# Altium project SUBBOARD-aux_supply.PrjPcb
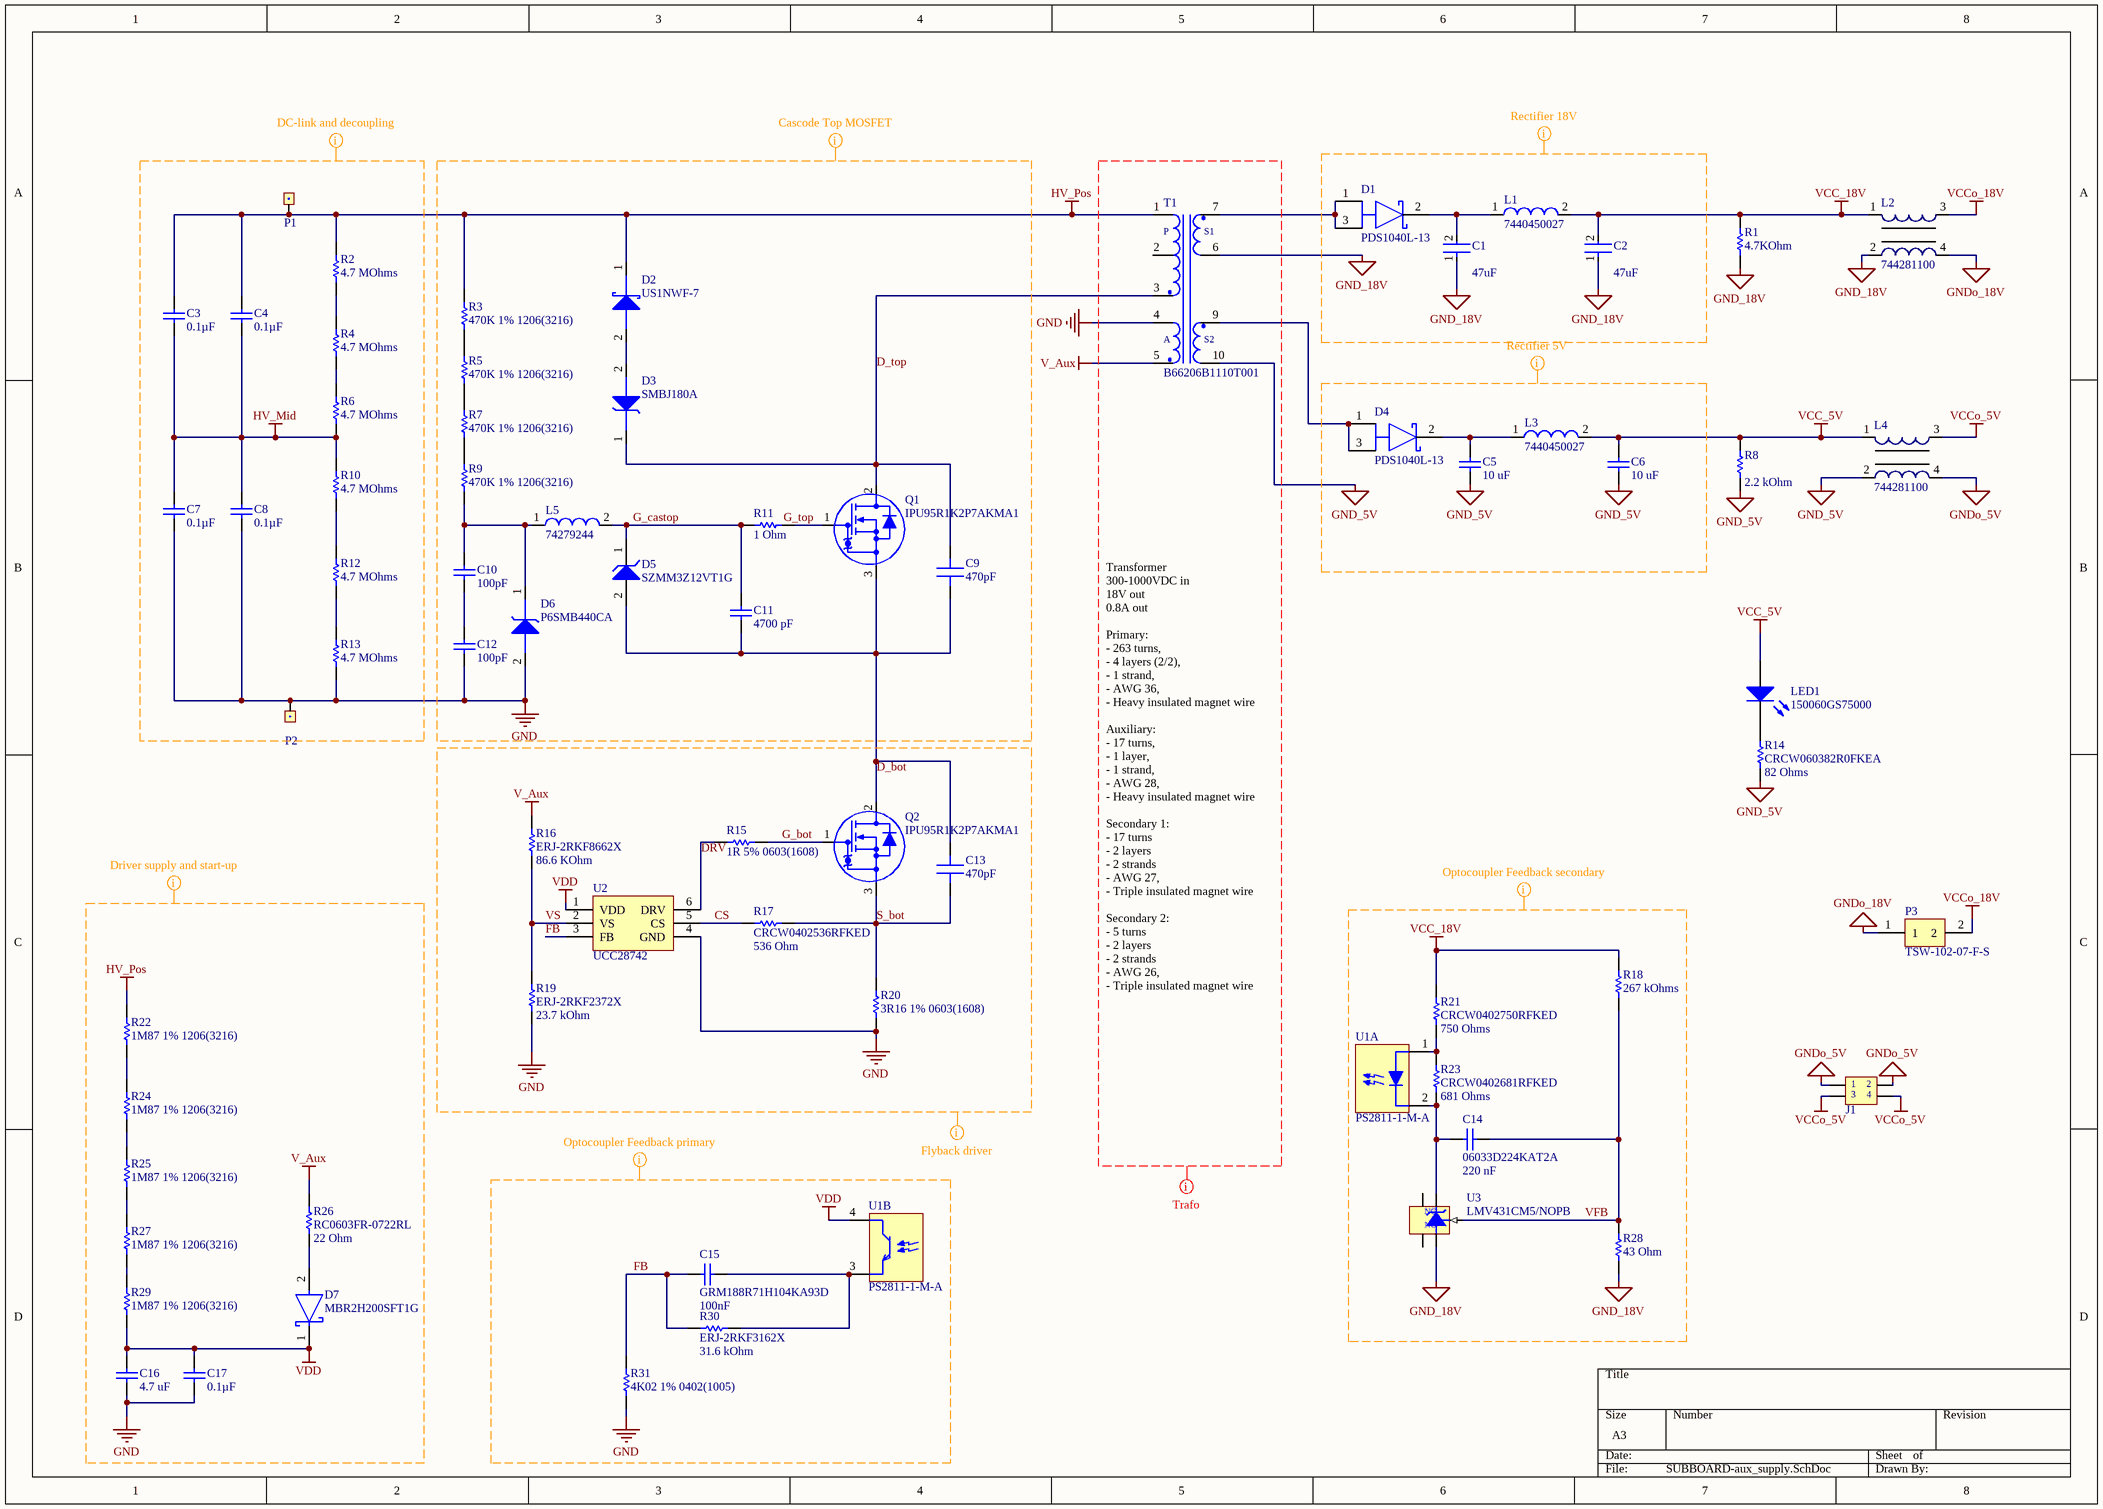
[diagram p0: SUBBOARD-aux_supply.SchDoc]
1 sheet, 71 parts. Net scope: global (net labels, ports and power ports of the same name join across sheets).
Board file: SUBBOARD-aux_supply.PcbDoc

## Sheet SUBBOARD-aux_supply.SchDoc
size A3

### Parts
C1  value 47uF  [FP-C3216-160-MFG]  (hidden comment: C3216X5R1E476M160AC)
C2  value 47uF  [FP-C3216-160-MFG]  (hidden comment: C3216X5R1E476M160AC)
C3  Capacitance: 0.1µF  [VISH-VJ1812-2_L]  (hidden comment: VJ1812Y104KXEAT5Z)
C4  Capacitance: 0.1µF  [VISH-VJ1812-2_L]  (hidden comment: VJ1812Y104KXEAT5Z)
C5  value 10 uF  [CAPC2013X140X45NL15T25]  (hidden comment: GRM21BR71A106KE51L)
C6  value 10 uF  [CAPC2013X140X45NL15T25]  (hidden comment: GRM21BR71A106KE51L)
C7  Capacitance: 0.1µF  [VISH-VJ1812-2_L]  (hidden comment: VJ1812Y104KXEAT5Z)
C8  Capacitance: 0.1µF  [VISH-VJ1812-2_L]  (hidden comment: VJ1812Y104KXEAT5Z)
C9  Capacitance: 470pF  [CAPC1808(4520)215_L]  (hidden comment: C4520X7R3A471K130KA)
C10  value 100pF  [CAPC1206(3216)170_L]  (hidden comment: CAP 100pF 500V 1206(3216))
C11  Capacitance: 4700 pF  [CAPC2013X110X50LL20T25]  (hidden comment: C0805C472J5RACTU)
C12  value 100pF  [CAPC1206(3216)170_L]  (hidden comment: CAP 100pF 500V 1206(3216))
C13  Capacitance: 470pF  [CAPC1808(4520)215_L]  (hidden comment: C4520X7R3A471K130KA)
C14  06033D224KAT2A  Capacitance: 220 nF  [CAPC1608X90X35NL15T15]
C15  GRM188R71H104KA93D  Capacitance: 100nF  [CAPC1608X90X35LL10T15]
C16  Capacitance: 4.7 uF  [CAPC2013X95X45NL15T25]  (hidden comment: GRM219R6YA475MA73D)
C17  Capacitance: 0.1µF  [SAMS-C0603-2_L]  (hidden comment: CL10B104KB8NNNC)
D1  PDS1040L-13  [FP-PowerDI5-MFG]
D2  US1NWF-7  [SOD123F]
D3  SMBJ180A  [DO-214AA SMB]
D4  PDS1040L-13  [FP-PowerDI5-MFG]
D5  SZMM3Z12VT1G  [ONSC-SOD-323-2-477-02_V]
D6  P6SMB440CA  [DO-214AA SMB]
D7  MBR2H200SFT1G  [FP-498-MFG]
J1  SQT-102-01-F-D  [SQT-102-01-F-D]  (value not drawn)
L1  7440450027  [WE-LQ-L]
L2  744281100  [WE-SCC 7345]
L3  7440450027  [WE-LQ-L]
L4  744281100  [WE-SCC 7345]
L5  74279244  [SMD-1806]
LED1  150060GS75000  [0603_A]
P1  TSW-101-07-F-S  [TSW-101-07-F-S]  (value not drawn)
P2  TSW-101-07-F-S  [TSW-101-07-F-S]  (value not drawn)
P3  TSW-102-07-F-S  [TSW-102-07-F-S]
Q1  IPU95R1K2P7AKMA1  [IPAK]
Q2  IPU95R1K2P7AKMA1  [IPAK]
R1  Resistance: 4.7KOhm  [RESC3216X60X45LL15T20]  (hidden comment: CRCW12064K70FKEA)
R2  value 4.7 MOhms  [RESC3216X60X45LL10T20]  (hidden comment: CRCW12064M70FKEA)
R3  470K 1% 1206(3216)  [RESC1206(3216)_L]
R4  value 4.7 MOhms  [RESC3216X60X45LL10T20]  (hidden comment: CRCW12064M70FKEA)
R5  470K 1% 1206(3216)  [RESC1206(3216)_L]
R6  value 4.7 MOhms  [RESC3216X60X45LL10T20]  (hidden comment: CRCW12064M70FKEA)
R7  470K 1% 1206(3216)  [RESC1206(3216)_L]
R8  value 2.2 kOhm  [RESC3216X60X45LL10T20]  (hidden comment: CRCW12062K20FKEA)
R9  470K 1% 1206(3216)  [RESC1206(3216)_L]
R10  value 4.7 MOhms  [RESC3216X60X45LL10T20]  (hidden comment: CRCW12064M70FKEA)
R11  value 1 Ohm  [RESC0603(1608)_L]  (hidden comment: 1R 5% 0603(1608))
R12  value 4.7 MOhms  [RESC3216X60X45LL10T20]  (hidden comment: CRCW12064M70FKEA)
R13  value 4.7 MOhms  [RESC3216X60X45LL10T20]  (hidden comment: CRCW12064M70FKEA)
R14  CRCW060382R0FKEA  value 82 Ohms  [RESC1609X50X30LL10T20]
R15  1R 5% 0603(1608)  [RESC0603(1608)_L]
R16  ERJ-2RKF8662X  Resistance: 86.6 KOhm  [RESC1005X40X25ML05T05]
R17  CRCW0402536RFKED  Resistance: 536 Ohm  [RESC1005X40X25ML05T05]
R18  Resistance: 267 kOhms  [RESC1005X40X25NL05T05]  (hidden comment: CRCW0402267KFKED)
R19  ERJ-2RKF2372X  Resistance: 23.7 kOhm  [RESC1005X40X25NL05T05]
R20  3R16 1% 0603(1608)  [RESC0603(1608)_L]
R21  CRCW0402750RFKED  Resistance: 750 Ohms  [RESC1005X40X25NL05T05]
R22  1M87 1% 1206(3216)  [RESC1206(3216)_L]
R23  CRCW0402681RFKED  Resistance: 681 Ohms  [RESC1005X40X25LL05T05]
R24  1M87 1% 1206(3216)  [RESC1206(3216)_L]
R25  1M87 1% 1206(3216)  [RESC1206(3216)_L]
R26  RC0603FR-0722RL  Resistance: 22 Ohm  [RESC1608X55X25NL10T15]
R27  1M87 1% 1206(3216)  [RESC1206(3216)_L]
R28  Resistance: 43 Ohm  [RESC1005X40X25ML05T05]  (hidden comment: ERJ-2GEJ430X)
R29  1M87 1% 1206(3216)  [RESC1206(3216)_L]
R30  ERJ-2RKF3162X  Resistance: 31.6 kOhm  [RESC1005X40X25NL05T05]
R31  4K02 1% 0402(1005)  [RESC0402(1005)_N]
T1  B66206B1110T001  [B66206B1110T001]
U1  PS2811-1-M-A  [SOP127P700X210-4L]  (parts A,B of 2)
U2  UCC28742  [SOT95P280X145-6L]
U3  LMV431CM5/NOPB  [DBV0005A_L]

### Nets
GND: C7.2 C8.2 C12.1 C16.1 C17.2 D6.2(Anode) P2.1 R13.1 R19.2 R20.1 R31.1 T1.4 U2.4(GND)
GND_5V: C5.1 C6.1 L4.2 R8.2 R14.2 T1.10
GND_18V: C1.1 C2.1 L2.2 R1.2 R28.2 T1.6 U3.5(A)
GNDo_5V: J1.1 J1.2 L4.4
GNDo_18V: L2.4 P3.1
HV_Mid: C3.2 C4.2 C7.1 C8.1 R6.1 R10.2
HV_Pos: C3.1 C4.1 D2.1(Cathode) P1.1 R2.2 R3.2 R22.2 T1.1
V_Aux: R16.1 R26.2 T1.5
VCC_5V: C6.2 L3.2 L4.1 LED1.2(A) R8.1
VCC_18V: C2.2 L1.2 L2.1 R1.1 R18.1 R21.1
VCCo_5V: J1.3 J1.4 L4.3
VCCo_18V: L2.3 P3.2
VDD: C16.2 C17.1 D7.1(C) R29.1 U1.4 U2.1(VDD)
CS: R17.2 U2.5(CS)
D_bot: C9.1 C11.1 C13.2 D5.2(A) Q1.3(S) Q2.2(D)
D_top: C9.2 D3.1(Cathode) Q1.2(D) T1.3
DRV: R15.1 U2.6(DRV)
FB: C15.2 R30.2 R31.2 U2.3(FB)
G_bot: Q2.1(G) R15.2
G_castop: C11.2 D5.1(K) L5.2 R11.2
G_top: Q1.1(G) R11.1
S_bot: C13.1 Q2.3(S) R17.1 R20.2
VFB: C14.1 R18.2 R28.1 U3.4(REF)
VS: R16.2 R19.1 U2.2(VS)
NetC1_2: C1.2 D1.2(C) L1.1
NetC5_2: C5.2 D4.2(C) L3.1
NetC10_1: C10.1 C12.2
NetC10_2: C10.2 D6.1(Cathode) L5.1 R9.1
NetC14_2: C14.2 R23.2 U1.2 U3.3(K)
NetC15_1: C15.1 R30.1 U1.3
NetD1_1: D1.1(A) D1.3(A) T1.7
NetD2_2: D2.2(Anode) D3.2(Anode)
NetD4_1: D4.1(A) D4.3(A) T1.9
NetD7_2: D7.2(A) R26.1
NetLED1_1: LED1.1(K) R14.1
NetR2_1: R2.1 R4.2
NetR3_1: R3.1 R5.2
NetR4_1: R4.1 R6.2
NetR5_1: R5.1 R7.2
NetR7_1: R7.1 R9.2
NetR10_1: R10.1 R12.2
NetR12_1: R12.1 R13.2
NetR21_2: R21.2 R23.1 U1.1
NetR22_1: R22.1 R24.2
NetR24_1: R24.1 R25.2
NetR25_1: R25.1 R27.2
NetR27_1: R27.1 R29.2

Not connected (* = marked no-connect by the designer): T1 2(3); U3 1(NC) 2(NC)

### Layout directives
mark named Rectifier 18V: GND_18V
mark named Trafo: (no net found under the mark)
mark named Cascode Top MOSFET: D_top, G_castop, G_top, GND
mark named Driver supply and start-up: GND, HV_Pos, V_Aux, VDD
mark named Optocoupler Feedback primary: FB, GND, VDD
mark named Flyback driver: CS, D_bot, DRV, FB, G_bot, GND, S_bot, V_Aux, VDD, VS
mark named Optocoupler Feedback secondary: GND_18V, VCC_18V, VFB
mark named DC-link and decoupling: HV_Mid
mark named Rectifier 5V: GND_5V

### Notes on the sheet
- Transformer
  300-1000VDC in
  18V out
  0.8A out
  Primary:
  - 263 turns,
  - 4 layers (2/2),
  - 1 strand,
  - AWG 36,
  - Heavy insulated magnet wire
  Auxiliary:
  - 17 turns,
  - 1 layer,
  - 1 strand,
  - AWG 28,
  - Heavy insulated magnet wire
  Secondary 1:
  - 17 turns
  - 2 layers
  - 2 strands
  - AWG 27,
  - Triple insulated magnet wire
  Secondary 2:
  - 5 turns
  - 2 layers
  - 2 strands
  - AWG 26,
  - Triple insulated magnet wire
- (in symbol B66206B1110T001) P; S1; A; S2

### Library data of the parts
C1 C2 = CMP-08246-000014-1: CAP CER 47UF 25V X5R 1206; 3DS Part Number: 220-00004; Manufacturer: TDK; Temperature Coefficient: 15%; Tolerance: 20%; Material: Ceramic; Height: 1.8mm; Device Class L1: Passive Components; Temperature Characteristic: X5R; Voltage: 25V; Digikey Description: CAP CER 47UF 25V X5R 1206; Voltage Rating: 25V; ComponentLink2URL: https://product.tdk.com/info/en/catalog/datasheets/mlcc_commercial_general_en.pdf; Category: Cap; Capacitance: 47uF; Ipc Land Pattern Name: CAPC320160X160; Temperature Range High: +85°C; ComponentLink2Description: Datasheet; Temperature: -55°C to +85°C; Mouser Description: Multilayer Ceramic Capacitors MLCC - SMD/SMT 1206 47uF 25volts X5R 20%; Lead Free: Yes; RoHS: TRUE; Device Class L2: Capacitors; Device Class L3: Ceramic Capacitors; Manufacturer Part Number: C3216X5R1E476M160AC; Automotive: No; Temperature Range Low: -55°C; Footprint Url: https://product.tdk.com/info/en/catalog/spec/mlccspec_commercial_general_midvoltage_en.pdf; Octopart: https://octopart.com/c3216x5r1e476m160ac-tdk-25947783; Package: C3216-160
C3 C4 C7 C8 = CMP-2000-07391-1: Multilayer Ceramic Chip Capacitor, 0.1 uF, +/- 10%, -55 to 125 degC, 2-Pin SMD (1812), RoHS, Tape and Reel; Manufacturer: Vishay; Other Names: 720-1003-6; Featured Product: VJHVArcGuard®Surface-MountMLCCs; Voltage - Rated: 500V; Catalog Drawings: VJHVArcSeries_1812; Design Resources: 20WNon-IsolatedBuckLEDDriverUsingPLLNK460KG; Online Catalog: VJHVArcGuard™Series; Product Training Modules: HVArcGuardsurfacemountMLCC; Temperature Coefficient: X7R; Datasheet URL: http://www.farnell.com/datasheets/1814151.pdf; Lead Spacing: -; Category: Capacitors; Size / Dimension: 0.177"Lx0.126"W(4.50mmx3.20mm); Thickness (Max): 0.086"(2.18mm); Family: CeramicCapacitors; Mounting Technology: SurfaceMount; Datasheet Version: 08/2013; Tolerance: ±10%; Ratings: -; Features: HighVoltage,ArcGuard™; Package / Case: 1812(4532Metric); Operating Temperature: -55°C~125°C; Manufacturer URL: http://www.vishay.com/; Mounting Type: SurfaceMount,MLCC; Package Description: 2-Pin Chip Capacitor, Body 4.5 x 3.2 mm; Applications: GeneralPurpose; Standard Package: 1; Series: VJHVArcGuard™; Lead Style: -; Packaging: Digi-Reel®; Height - Seated (Max): -; Package Reference: 1812
C5 C6 = CMP-2007-03395-1: Manufacturer: Murata; Part Number: GRM21BR71A106KE51L
C9 C13 = C4520X7R3A471K130KA: CAP CER 470PF 1KV X7R 1808; Manufacturer: TDK; Tolerance: 10%; Manufacturer Part Number: C4520X7R3A471K130KA; RoHS: Yes; Category: Ceramic Capacitors; Stock 1: 355; Pricing 1: 1=0,63000, 10=0,46200, 50=0,36960, 100=0,31680, 500=0,25080 (USD); Mount: Surface Mount; Case/Package: 1808; Number of Pins: 2; Weight: 0.000952oz; Case Code (Metric): 4520; Case Code (Imperial): 1808; Min Operating Temperature: -55°C; Max Operating Temperature: 125°C; Voltage Rating (DC): 1kV; Packaging: Tape and Reel; Dielectric: X7R; Termination: SMD/SMT; Voltage Rating: 1kV; Package Quantity: 1; Composition: Ceramic; Length: 4.5mm; Width: 0.079inch; Thickness: 0.059inch; Depth: 2mm; Radiation Hardening: No; REACH SVHC: Unknown; ComponentLink1URL: https://datasheet.ciiva.com/24217/c4520x7r3a471k130ka-265396-24217566.pdf?src-supplier=Mouser; ComponentLink1Description: https://datasheet.ciiva.com/24217/c4520x7r3a471k130ka-265396-24217566.pdf?src-supplier=Mouser; ComponentLink2URL: https://datasheet.ciiva.com/26834/getdatasheetpartid-743674-26834495.pdf?src-supplier=Verical; ComponentLink2Description: https://datasheet.ciiva.com/26834/getdatasheetpartid-743674-26834495.pdf?src-supplier=Verical; ComponentLink3URL: https://datasheet.ciiva.com/6286/mlcc-commercial-highvoltage-en-6286556.pdf?src-supplier=Digi-Key; ComponentLink3Description: https://datasheet.ciiva.com/6286/mlcc-commercial-highvoltage-en-6286556.pdf?src-supplier=Digi-Key; ComponentLink4URL: https://datasheet.ciiva.com/6286/mlcc-commercial-highvoltage-en-6286559.pdf?src-supplier=Digi-Key; ComponentLink4Description: https://datasheet.ciiva.com/6286/mlcc-commercial-highvoltage-en-6286559.pdf?src-supplier=Digi-Key; Supplier 1: Digi-Key; Supplier 2: Digi-Key; Supplier 3: Arrow; Supplier 4: Mouser; Supplier Part Number 1: 445-2383-1-ND; Supplier Part Number 2: 445-2383-6-ND; Supplier Part Number 3: C4520X7R3A471K130KA; Supplier Part Number 4: 810-C4520X7R3A471K
C10 C12 = CMP-1037-01597-1: CAP 100pF 500V ±2% 1206 (3216 Metric) Thickness 1.7mm SMD; Tolerance: Â±2%; Case-Metric: 3216; Case-EIA: 1206; Rated Voltage: 500 V; Technology: SMT; Max Thickness: 1.7 mm
C11 = CMP-2007-03655-1: Manufacturer: Kemet; Part Number: C0805C472J5RACTU
C14 = CMP-2006-04195-1: Manufacturer: AVX Interconnect / Elco; Part Number: 06033D224KAT2A
C15 = CMP-2100-03643-1: Chip Capacitor, 0.1 uF, +/- 10%, 50 V, -55 to 125 degC, 0603 (1608 Metric), RoHS, Tape and Reel; Manufacturer: Murata; Dielectric Material: Ceramic; Voltage Rating: 50V; Dielectric: X7R; Insulation Resistance: 10GR; Case Code (Metric): 1608; Lead Free: LeadFree; Depth: 0.8mm; Number of Pins: 2; Radiation Hardening: No; Case/Package: 0603; Manufacturer URL: http://www.murata.com/; Packaging: TapeandReel; Length: 1.6mm; Contact Plating: Tin; Datasheet URL: http://psearch.en.murata.com/capacitor/product/GRM188R71H104KA93%23.pdf; Tolerance: 10%; Case Code (Imperial): 0603; Min Operating Temperature: -55degC; RoHSCompliant: true; Voltage: 50V; Termination: SMD/SMT; Mount: SurfaceMount; Material: Ceramic; Package Quantity: 1; Height: 0.8mm; Thickness: 0.035inch; REACH SVHC: NoSVHC; Max Operating Temperature: 125degC; Width: 0.8mm; Package Reference: 0603; Voltage Rating (DC): 50V; Datasheet Version: 42675.0; Package Description: 2-Pin Surface Mount Device, Body 1.6 x 0.8 mm
C16 = CMP-2007-00095-1: Manufacturer: Murata; Part Number: GRM219R6YA475MA73D
C17 = CMP-2000-05332-1: Multi-layer Ceramic Capacitor, -55 to 125 degC, 2-Pin SMD (0603), RoHS, Tape and Reel; Manufacturer: Samsung Electro-Mechanics; Rated Voltage: 50V; Dielectric: X7R; Tolerance (%): ±10%; Case Size/Dimension: 0603; Datasheet URL: https://datasheet.ciiva.com/29198/456651-da-01-en-vs-kondensator-0605-29198839.pdf; Manufacturer URL: http://www.samsungsem.com/global/index.jsp; Datasheet Version: Nov-10
D1 D4 = CMP-12790-000057-1: DIODE SCHOTTKY 40V 10A POWERDI5; Manufacturer: Diodes Inc.; Max Junction Temp: +150°C; Standoff Height: 0mm; Automotive Grade: Grade 0; Peak Reverse Current: 0.07mA; Max Surge Forward Current: 275A; Temperature Range Low: -65°C; Digikey Description: DIODE SCHOTTKY 40V 10A POWERDI5; Lead Free: Yes; Device Class L3: Schottky Diodes; Forward Current: 10A; ComponentLink2Description: Datasheet; Device Class L2: Diodes; Octopart: https://octopart.com/pds1040l-13-diodes+inc.-332540; Device Class L1: Discrete Semiconductors; Footprint Url: https://www.diodes.com/assets/Package-Files/PowerDI5.pdf; Automotive: Yes; Temperature Range High: +150°C; Mouser Description: PDS1040L Series 40 V 10 A Low VF Schottky Barrier Rectifier - PowerDI? 5; Temperature: -65°C to +150°C; RoHS: TRUE; ComponentLink2URL: https://www.diodes.com/assets/Datasheets/ds30486.pdf; Reverse Voltage: 40V; Height: 1.15mm; Manufacturer Part Number: PDS1040L-13; Package: PowerDI5; Max Repetitive Reverse Voltage: 40V; Category: Diode
D2 = US1NWF-7: DIODE GEN PURP 1.2KV 1A SOD123F; Manufacturer: Diodes; Reverse Recovery Time: 80ns; Manufacturer Part Number: US1NWF-7; RoHS: No; Category: Rectifier Diodes; Stock 1: 6339; Pricing 1: 1=0,50000, 10=0,40300, 25=0,36840, 100=0,23130, 250=0,22868, 500=0,21412, 1000=0,14561 (USD); Mount: Surface Mount; Packaging: Tape and Reel; Max Reverse Voltage (DC): 1.2kV; Average Rectified Current: 1A; ComponentLink1URL: https://www.diodes.com/assets/Datasheets/US1NWF.pdf?src-supplier=Digi-Key; ComponentLink1Description: https://www.diodes.com/assets/Datasheets/US1NWF.pdf?src-supplier=Digi-Key; Supplier 1: Digi-Key; Supplier 2: Mouser; Supplier Part Number 1: US1NWF-7DICT-ND; Supplier Part Number 2: 621-US1NWF-7
D3 = SMBJ180A: Diode TVS Single Uni-Dir 180V 600W 2-Pin SMB T/R; Manufacturer: Littelfuse; Min Breakdown Voltage: 201V; Clamping Voltage: 292V; Peak Pulse Current: 2.1A; Direction: Unidirectional; Test Current: 1mA; Number of Unidirectional Channels: 1; Power Line Protection: No; Max Breakdown Voltage: 222V; Leakage Current: 1uA; Manufacturer Part Number: SMBJ180A; RoHS: Yes; Category: TVS Diodes; Stock 1: 3159; Pricing 1: 1=0,48000, 10=0,40900, 25=0,38160, 100=0,28340, 250=0,26924, 500=0,22128, 1000=0,17985 (USD); Mount: Surface Mount; Case/Package: SMB; Number of Pins: 2; Min Operating Temperature: -55°C; Max Operating Temperature: 150°C; Peak Pulse Power: 600W; Reverse Standoff Voltage: 180V; Packaging: Tape and Reel; Composition: Zener; Package Quantity: 3000; Operating Supply Voltage: 180V; Number of Channels: 1; Polarity: Unidirectional; Termination: SMD/SMT; Voltage Rating (DC): 180V; Max Surge Current: 2.1A; Breakdown Voltage: 201V; Reverse Breakdown Voltage: 201V; Power Dissipation: 600W; Number of Elements: 1; Length: 5.59mm; Height: 2.44mm; Width: 3.94mm; Lead Free: Lead Free; ComponentLink1URL: https://datasheet.ciiva.com/26787/smbj180a-26787834.pdf?src-supplier=IIIC; ComponentLink1Description: https://datasheet.ciiva.com/26787/smbj180a-26787834.pdf?src-supplier=IIIC; ComponentLink2URL: https://datasheet.ciiva.com/4516/littelfuse-tvs-diode-smbj-48653-4516011.pdf?src-supplier=Mouser; ComponentLink2Description: https://datasheet.ciiva.com/4516/littelfuse-tvs-diode-smbj-48653-4516011.pdf?src-supplier=Mouser; ComponentLink3URL: https://datasheet.ciiva.com/331/littelfuse-tvs-diode-smbj-datasheet-pdf-331907.pdf?src-supplier=Digi-Key; ComponentLink3Description: https://datasheet.ciiva.com/331/littelfuse-tvs-diode-smbj-datasheet-pdf-331907.pdf?src-supplier=Digi-Key; ComponentLink4URL: https://datasheet.ciiva.com/331/littelfuse-tvs-diode-smbj-datasheet-pdf-331908.pdf?src-supplier=Digi-Key; ComponentLink4Description: https://datasheet.ciiva.com/331/littelfuse-tvs-diode-smbj-datasheet-pdf-331908.pdf?src-supplier=Digi-Key; ComponentLink5URL: https://datasheet.ciiva.com/331/littelfuse-tvs-diode-smbj-datasheet-pdf-331909.pdf?src-supplier=Digi-Key; ComponentLink5Description: https://datasheet.ciiva.com/331/littelfuse-tvs-diode-smbj-datasheet-pdf-331909.pdf?src-supplier=Digi-Key; ComponentLink6URL: https://datasheet.ciiva.com/16487/littelfuse-tvs-diode-smbj-16487606.pdf?src-supplier=Future+Electronics; ComponentLink6Description: https://datasheet.ciiva.com/16487/littelfuse-tvs-diode-smbj-16487606.pdf?src-supplier=Future+Electronics; Supplier 1: Digi-Key; Supplier 2: Arrow; Supplier 3: Mouser; Supplier 4: Farnell; Supplier 5: Newark; Supplier Part Number 5: 33AC0976; Supplier Part Number 4: 2777262; Supplier Part Number 3: 576-SMBJ180A; Supplier Part Number 2: SMBJ180A; Supplier Part Number 1: SMBJ180ALFCT-ND
D5 = CMP-1060-00727-1: Zener Voltage Regulator, 300 mW, 2-Pin SOD-323, Pb-Free, Tape and Reel; Manufacturer: On Semiconductor; VZ Typ (V): 12; P Max (W): 0.3; RoHS: Pb-Free; PackageReference: SOD-323-2-477-02; ComponentLink2Description: Datasheet; ComponentLink1URL: http://www.onsemi.com/; ComponentLink2URL: http://www.onsemi.cn/pub_link/Collateral/MM3Z2V4T1-D.PDF; PartNumber: SZMM3Z12VT1G; PackageVersion: Rev. H, 03/2007; ComponentLink3Description: Package Specification; ComponentLink1Description: Manufacturer URL; Packing: Tape and Reel; PackageDescription: 2-Pin SOD, Body 1.7 x 1.25 mm; ComponentLink3URL: http://www.onsemi.com/pub_link/Collateral/477-02.PDF.1; DatasheetVersion: Rev. 9; Mounting Technology: Surface Mount
D6 = P6SMB440CA: LITTELFUSE - P6SMB440CA - TVS Diode, P6SMB series, Bidirectional, 376 V, 602 V, DO-214AA, 2 Pins; Clamping Voltage: 602V; Peak Pulse Power: 600W; Number of Bidirectional Channels: 1; Reverse Standoff Voltage: 376V; Min Breakdown Voltage: 418V; Power Line Protection: No; Peak Pulse Current: 1A; Leakage Current: 1uA; Test Current: 1mA; Max Breakdown Voltage: 462V; Max Power Dissipation: 5W; Manufacturer: Littelfuse; Manufacturer Part Number: P6SMB440CA; RoHS: Yes; Category: TVS Diodes; Stock 1: 22565; Pricing 1: 1=0,61000, 10=0,53800, 25=0,50560, 100=0,36690, 250=0,35388, 500=0,30660, 1000=0,26093 (USD); Mount: Surface Mount; Case/Package: SMB; Number of Pins: 2; Min Operating Temperature: -65°C; Max Operating Temperature: 150°C; Composition: Zener; Polarity: Bidirectional; Packaging: Tape and Reel; Package Quantity: 3000; Reverse Breakdown Voltage: 418V; Breakdown Voltage: 418V; Termination: SMD/SMT; Number of Channels: 1; Number of Elements: 1; Power Dissipation: 600W; Direction: Bidirectional; Operating Supply Voltage: 376V; Max Surge Current: 1A; Lead Free: Lead Free; REACH SVHC: No SVHC; ComponentLink1URL: https://datasheet.ciiva.com/26787/p6smb440ca-26787394.pdf?src-supplier=IIIC; ComponentLink1Description: https://datasheet.ciiva.com/26787/p6smb440ca-26787394.pdf?src-supplier=IIIC; ComponentLink2URL: https://datasheet.ciiva.com/8062/littelfuse-tvs-diodes-p6smb-8062501.pdf?src-supplier=Element14; ComponentLink2Description: https://datasheet.ciiva.com/8062/littelfuse-tvs-diodes-p6smb-8062501.pdf?src-supplier=Element14; ComponentLink3URL: https://datasheet.ciiva.com/331/littelfuse-tvs-diode-p6smb-datasheet-pdf-331974.pdf?src-supplier=Digi-Key; ComponentLink3Description: https://datasheet.ciiva.com/331/littelfuse-tvs-diode-p6smb-datasheet-pdf-331974.pdf?src-supplier=Digi-Key; ComponentLink4URL: https://datasheet.ciiva.com/331/littelfuse-tvs-diode-p6smb-datasheet-pdf-331975.pdf?src-supplier=Digi-Key; ComponentLink4Description: https://datasheet.ciiva.com/331/littelfuse-tvs-diode-p6smb-datasheet-pdf-331975.pdf?src-supplier=Digi-Key; ComponentLink5URL: https://datasheet.ciiva.com/331/littelfuse-tvs-diode-p6smb-datasheet-pdf-331976.pdf?src-supplier=Digi-Key; ComponentLink5Description: https://datasheet.ciiva.com/331/littelfuse-tvs-diode-p6smb-datasheet-pdf-331976.pdf?src-supplier=Digi-Key; ComponentLink6URL: https://datasheet.ciiva.com/14162/p6smb-eng-ds-14162043.pdf?src-supplier=Distrelec; ComponentLink6Description: https://datasheet.ciiva.com/14162/p6smb-eng-ds-14162043.pdf?src-supplier=Distrelec; Supplier 1: Digi-Key; Supplier 2: Digi-Key; Supplier 3: Digi-Key; Supplier 4: Arrow; Supplier 5: Mouser; Supplier 6: Farnell; Supplier 7: Newark; Supplier Part Number 7: 85R4928; Supplier Part Number 6: 2762990; Supplier Part Number 5: 576-P6SMB440CA; Supplier Part Number 4: P6SMB440CA; Supplier Part Number 3: P6SMB440CALFTR-ND; Supplier Part Number 2: P6SMB440CALFDKR-ND; Supplier Part Number 1: P6SMB440CALFCT-ND
D7 = CMP-07162-000008-1: DIODE SCHOTTKY 200V 2A SOD123FL; Manufacturer: ON Semiconductor; Peak Reverse Current: 200uA; Max Surge Forward Current: 30A; Max Junction Temp: +150°C; Standoff Height: 0mm; Device Class L1: Discrete Semiconductors; Package: 498; Temperature Range High: +150°C; Height: 0.98mm; Temperature: -55°C to +150°C; Forward Current: 2A; Octopart: https://octopart.com/mbr2h200sft1g-on+semiconductor-51167333; Reverse Voltage: 200V; Max Repetitive Reverse Voltage: 200V; RoHS: TRUE; Lead Free: Yes; Footprint Url: https://www.onsemi.com/pub/Collateral/498-01.PDF; ComponentLink2Description: Datasheet; Category: Diode; Manufacturer Part Number: MBR2H200SFT1G; Digikey Description: DIODE SCHOTTKY 200V 2A SOD123FL; Device Class L3: Schottky Diodes; Temperature Range Low: -55°C; ComponentLink2URL: https://www.onsemi.com/pub/Collateral/MBR2H200SF-D.PDF; Automotive: No; Device Class L2: Diodes
J1 = SQT-102-01-F-D: Conn Socket Strip SKT 4 POS 2mm Solder ST Thru-Hole; Manufacturer: Samtec; Number of Contacts: 4; Gender: Female; Voltage Rating (AC): 450V; Max Current Rating: 5.5A; Contact Resistance: 10mR; Supplier 1: Digi-Key; Manufacturer Part Number: SQT-102-01-F-D; RoHS: Yes; Category: Headers and Wire Housings; Stock 1: 575; Pricing 1: 1=1.22000, 10=1.07100, 100=0.92400, 500=0.75600, 1000=0.67200, 5000=0.58800, 10000=0.55860 (USD); Contact Plating: Gold; Contact Material: Bronze; Housing Color: Black; Housing Material: Polymer; Min Operating Temperature: -55°C; Max Operating Temperature: 125°C; Termination: Solder; Number of Rows: 2; Packaging: Bulk; Orientation: Straight; Max Voltage Rating (AC): 450V; Length: 4.3mm; Pitch: 2mm; Depth: 4mm; Radiation Hardening: No; Lead Free: Lead Free; ComponentLink1URL: http://components.arrow.com/part/dataview/0323_04808073?src-supplier=Arrow+Europe; ComponentLink1Description: http://components.arrow.com/part/dataview/0323_04808073?src-supplier=Arrow+Europe; ComponentLink2URL: http://www.samtec.com/documents/webfiles/pdf/SQT_TH.PDF?src-supplier=Avnet+Europe; ComponentLink2Description: http://www.samtec.com/documents/webfiles/pdf/SQT_TH.PDF?src-supplier=Avnet+Europe; ComponentLink3URL: http://suddendocs.samtec.com/catalog_english/sqt_th.pdf?src-supplier=Digi-Key; ComponentLink3Description: http://suddendocs.samtec.com/catalog_english/sqt_th.pdf?src-supplier=Digi-Key; ComponentLink4URL: http://www.samtec.com/documents/webfiles/pdf/SQT_TH.PDF?src-supplier=Avnet; ComponentLink4Description: http://www.samtec.com/documents/webfiles/pdf/SQT_TH.PDF?src-supplier=Avnet; Supplier Part Number 1: SAM9978-ND
L1 L3 = CMP-0227-00628-1: SMD-RF-Inductor WE-LQ, L = 2.70 µH; Inductance: 2.70 ÂµH; PackageReference: WE-LQ-L; DatasheetVersion: ver 3, Jul-2006; PackageDescription: Inductor, 2-Leads, Body 4.5 x 3.2 mm; ComponentLink1Description: Manufacturer Link; ComponentLink2Description: Datasheet; ComponentLink2URL: http://www.we-online.de/katalog/media/pdf/7440450027.pdf; PackageVersion: 2006; ComponentLink1URL: http://www.we-online.com
L2 L4 = CMP-1399-00008-1: SMD Common Mode Line Filter WE-SCC, L=10.0 µH; Manufacturer: Wuerth Elektronik; Inductance: 10.0 ÂµH; ComponentLink2Description: Datasheet; ComponentLink2URL: http://www.we-online.de/katalog/media/pdf/744281100.pdf; ComponentLink1URL: http://www.we-online.com; ComponentLink1Description: Manufacturer URL; PartNumber: 744281100; PackageReference: WE-SCC 7345
L5 = CMP-0220-00093-1: SMD EMI Suppression Ferrite Bead WE-CBF, Z = 850 Ohm; Impedance: 850 Ohm; PackageDescription: Chip Inductor, 2-Leads, Body 4.5 x 1.6 mm; ComponentLink1URL: http://www.we-online.com; ComponentLink2URL: http://www.we-online.de/katalog/media/pdf/74279244.pdf; PackageReference: SMD-1806; DatasheetVersion: Dec-2005; ComponentLink1Description: Manufacturer Link; PackageVersion: 2005; ComponentLink2Description: Datasheet
LED1 = CMP-1426-00002-1: SMD mono-color Chip LED, WL-SMCW, Green; Manufacturer: Wuerth Elektronik; ComponentLink1URL: http://www.we-online.com; ComponentLink2Description: Datasheet; Color: Green; ComponentLink2URL: http://katalog.we-online.com/led/datasheet/150060GS75000.pdf; PartNumber: 150060GS75000; PackageReference: 0603_A; ComponentLink1Description: Manufacturer URL
P1 P2 = TSW-101-07-F-S: In a Pack of 50, Samtec TSW, 1 Way, 1 Row, Straight PCB Header; Number of Contacts: 1; Gender: Male; System: Connector; Supplier 1: Digi-Key; Manufacturer: Samtec; Manufacturer Part Number: TSW-101-07-F-S; RoHS: Yes; Category: Connectors; Stock 1: 2331; Pricing 1: 1=0.13000, 10=0.11800, 100=0.07250, 500=0.06000, 1000=0.05250, 5000=0.04500, 10000=0.04375 (USD); Mount: Through Hole; Contact Material: Bronze; Contact Plating: Gold; Termination: Solder; Packaging: Bulk; Number of Rows: 1; Radiation Hardening: No; REACH SVHC: No SVHC; ComponentLink1URL: https://datasheet.ciiva.com/10337/htsw-th-10337052.pdf?src-supplier=Avnet; ComponentLink1Description: https://datasheet.ciiva.com/10337/htsw-th-10337052.pdf?src-supplier=Avnet; Supplier Part Number 1: SAM10323-ND
P3 = TSW-102-07-F-S: Conn Unshrouded Header HDR 2 POS 2.54mm Solder ST Thru-Hole; Manufacturer: Samtec; Number of Contacts: 2; Gender: Male; Max Voltage Rating (AC): 550V; Connector Type: Male Pin; Max Current Rating: 7.6A; Manufacturer Part Number: TSW-102-07-F-S; RoHS: Yes; Category: Connectors; Stock 1: 10739; Pricing 1: 1=0,20000, 10=0,18800, 100=0,13000, 500=0,11000, 1000=0,09000, 5000=0,08000, 10000=0,07250 (USD); Mount: Through Hole; Contact Plating: Gold; Contact Material: Bronze; Housing Color: Black; Housing Material: Polyester; Color: Black; Min Operating Temperature: -55°C; Max Operating Temperature: 125°C; Number of Rows: 1; Termination: Solder; Packaging: Rail/Tube; Orientation: Straight; Number of Positions: 2; Package Quantity: 1; Length: 5.08mm; Pitch: 2.54mm; Contact Mating Length: 0.23inch; Depth: 2.54mm; Radiation Hardening: No; REACH SVHC: No SVHC; ComponentLink1URL: https://datasheet.ciiva.com/739/tsw-xxx-xx-xxx-x-xx-xxx-mkt-739881.pdf?src-supplier=Digi-Key; ComponentLink1Description: https://datasheet.ciiva.com/739/tsw-xxx-xx-xxx-x-xx-xxx-mkt-739881.pdf?src-supplier=Digi-Key; ComponentLink2URL: https://datasheet.ciiva.com/10281/htsw-th-10281262.pdf?src-supplier=Avnet; ComponentLink2Description: https://datasheet.ciiva.com/10281/htsw-th-10281262.pdf?src-supplier=Avnet; ComponentLink3URL: https://datasheet.ciiva.com/16734/htsw-th-16734219.pdf?src-supplier=Avnet+Europe; ComponentLink3Description: https://datasheet.ciiva.com/16734/htsw-th-16734219.pdf?src-supplier=Avnet+Europe; Supplier 1: Digi-Key; Supplier 2: Arrow; Supplier 3: Mouser; Supplier 4: Farnell; Supplier 5: Newark; Supplier Part Number 5: 79P3146; Supplier Part Number 4: 2779661; Supplier Part Number 3: 200-TSW10207FS; Supplier Part Number 2: TSW-102-07-F-S; Supplier Part Number 1: SAM10844-ND
Q1 Q2 = IPU95R1K2P7AKMA1: Trans MOSFET N-CH 600V 6A 3-Pin(3+Tab) TO-251 Tube; Manufacturer: Infineon; Drain to Source Voltage (Vdss): 950V; Rds On Max: 1.2R; Input Capacitance: 478pF; Max Power Dissipation: 52W; Manufacturer Part Number: IPU95R1K2P7AKMA1; RoHS: No; Stock 1: 1606; Pricing 1: 1=1,44000, 10=1,28900, 25=1,22400, 100=0,91790, 250=0,90916, 500=0,77804, 1000=0,63380, 2500=0,62505, 5000=0,56823 (USD); Mount: Through Hole; Case/Package: TO-251-3; Min Operating Temperature: -55°C; Max Operating Temperature: 150°C; Packaging: Rail/Tube; Continuous Drain Current (ID): 6A; ComponentLink1URL: https://www.infineon.com/dgdl/Infineon-IPU95R1K2P7-DS-v02_00-EN.pdf?fileId=5546d462636cc8fb01643b6dc4e756f9&src-supplier=Digi-Key; ComponentLink1Description: https://www.infineon.com/dgdl/Infineon-IPU95R1K2P7-DS-v02_00-EN.pdf?fileId=5546d462636cc8fb01643b6dc4e756f9&src-supplier=Digi-Key; Supplier 1: Digi-Key; Supplier 2: Arrow; Supplier 3: Mouser; Supplier 4: Farnell; Supplier 5: Newark; Supplier Part Number 1: IPU95R1K2P7AKMA1-ND; Supplier Part Number 2: IPU95R1K2P7AKMA1; Supplier Part Number 3: 726-IPU95R1K2P7AKMA1; Supplier Part Number 4: 2916135; Supplier Part Number 5: 71AC0401
R1 = CMP-2100-03618-1: Chip Resistor, 4.7 KOhm, +/- 1%, 0.25 W, -55 to 155 degC, 1206 (3216 Metric), RoHS, Tape and Reel; Manufacturer: Vishay Semiconductor; Power Rating: 250mW; Voltage Rating: 200V; Temperature Coefficient: 100ppm/degreesC; Package Quantity: 10; Composition: ThickFilm; REACH SVHC: Unknown; Mount: SurfaceMount; Max Operating Temperature: 155degC; Length: 3.2mm; Number of Terminations: 2; Case Code (Metric): 3216; Military Standard: Not; Width: 1.6mm; Datasheet Version: 41061.0; Max Power Dissipation: 250mW; Datasheet URL: http://www.vishay.com/docs/20035/dcrcwe3.pdf; Contact Plating: Tin; Case/Package: 1206; Height: 0.55mm; Package Reference: 1206.0; Lead Free: LeadFree; Weight: 0.000353oz; Package Description: 2-Pin Surface Mount Device, Body 3.15 x 1.6 mm; Min Operating Temperature: -55degC; Packaging: TapeandReel; Depth: 1.6mm; Tolerance: 1%; RoHSCompliant: true; Termination: SMD/SMT; Case Code (Imperial): 1206; Voltage Rating (DC): 200V; Radiation Hardening: No; Manufacturer URL: http://www.vishay.com/
R2 R4 R6 R10 R12 R13 = CMP-2003-02243-1: Manufacturer: Vishay Dale; Part Number: CRCW12064M70FKEA; Package: 1206
R3 R5 R7 R9 = CMP-1014-00812-1: 470K 0.25W 1% 1206 (3216 Metric)  SMD; Value: 470000.00 Ohm; Case-EIA: 1206; Case-Metric: 3216; Tolerance: 1 %; Technology: SMT; Power: 0.25 W
R8 = CMP-2003-02034-1: Manufacturer: Vishay Dale; Part Number: CRCW12062K20FKEA; Package: 1206
R11 R15 = CMP-1012-00002-1: 1R 0.1W 5% 0603 (1608 Metric)  SMD; Value: 1.00 Ohm; Case-Metric: 1608; Case-EIA: 0603; Power: 0.1 W; Technology: SMT; Tolerance: 5 %
R14 = CMP-2000-03606-1: Manufacturer: Vishay Dale; Part Number: CRCW060382R0FKEA
R16 = CMP-2002-01090-3: Chip Resistor, 86.6 KOhm, +/- 1%, 100 mW, -55 to 155 degC, 0402 (1005 Metric), RoHS, Tape and Reel; Manufacturer: Basic Passives; Case\/Package: 0402; Voltage Rating: 50 V; Power Rating: 100 mW; ComponentLink2Description: Datasheet; Tolerance: 1%; ComponentLink2URL: http://industrial.panasonic.com/cdbs/www-data/pdf/RDA0000/AOA0000C86.pdf; Length: 1 mm; PartNumber: ERJ-2RKF8662X; DatasheetVersion: 04/2015; Packaging: Tape and Reel; Package Quantity: 10000; Height: 0.35 mm; Mounting Technology: Surface Mount; ComponentLink1URL: http://www.panasonic.com/; ComponentLink1Description: Manufacturer URL; PackageDescription: 2-Pin Surface Mount Device, Body 1 x 0.5 mm; REACH SVHC: Yes; Mount: Surface Mount; Width: 0.5 mm; Case Code (Metric): 1005; RoHSCompliant: true; Pins: 2; Case Code (Imperial): 0402; Min Operating Temperature: -55 degC; Max Operating Temperature: 155 degC; PackageReference: 0402
R17 = CMP-2002-00089-1: Manufacturer: Vishay Dale; Part Number: CRCW0402536RFKED
R18 = CMP-2002-08420-1: Manufacturer: Vishay Dale; Part Number: CRCW0402267KFKED
R19 = CMP-2002-00793-1: Manufacturer: Panasonic; Tolerance: 1%; Part Number: ERJ-2RKF2372X; Package: 0402
R20 = CMP-1012-00226-1: 3R16 0.1W 1% 0603 (1608 Metric)  SMD; Value: 3.16 Ohm; Case-EIA: 0603; Case-Metric: 1608; Power: 0.1 W; Tolerance: 1 %; Technology: SMT
R21 = CMP-2002-00206-1: Manufacturer: Vishay Dale; Part Number: CRCW0402750RFKED
R22 R24 R25 R27 R29 = CMP-1014-00878-1: 1M87 0.25W 1% 1206 (3216 Metric)  SMD; Value: 1870000.00 Ohm; Case-EIA: 1206; Case-Metric: 3216; Technology: SMT; Power: 0.25 W; Tolerance: 1 %
R23 = CMP-2002-00169-1: Manufacturer: Vishay Dale; Part Number: CRCW0402681RFKED
R26 = CMP-1659-00033-1: Chip Resistor, 22 Ohm, +/- 1%, 0.1 W, -55 to 155 degC, 0603 (1608 Metric), RoHS, Tape and Reel; Max Ouput Current: 8 A; Case\Package: SIP; Max Input Voltage: 1.4 V; ComponentLink2URL: http://www.yageo.com/documents/recent/PYu-RC_Group_51_RoHS_L_04.pdf; RoHSCompliant: true; Max Operating Temperature: 100 degC; PackageDescription: 2-Pin Surface Mount Device, Body 1.6 x 0.8 mm; ComponentLink1Description: Manufacturer URL; ComponentLink1URL: http://www.yageo.com/; Length: 18.5 mm; REACH SVHC: Unknown; Pins: 4; DatasheetVersion: Rev. 4, 02/2016; PackageReference: 0603; Output Current: 8 A; Min Operating Temperature: -25 degC; Height: 19.6 mm; Mount: Through Hole; Radiation Hardening: No; ComponentLink2Description: Datasheet; Package Quantity: 200; Packaging: Rail/Tube
R28 = CMP-2002-00536-1: Manufacturer: Panasonic; Part Number: ERJ-2GEJ430X; Package: 0402
R30 = CMP-2002-00862-1: Manufacturer: Panasonic; Tolerance: 1%; Part Number: ERJ-2RKF3162X; Package: 0402
R31 = CMP-1011-00578-1: 4K02 0.063W 1% 0402 (1005 Metric)  SMD; Case-EIA: 0402; Case-Metric: 1005; Value: 4020.00 Ohm; Technology: SMT; Tolerance: 1 %; Power: 0.063 W
T1 = B66206B1110T001: Flyback transformer 1 primary, 1 auxiliary, 2 secondary, E 20/10/6 (EF 20) Horizontal; Supplier 1: Digi-Key; Supplier 2: Arrow; Supplier 3: Mouser; Supplier 4: Farnell; Supplier 5: Newark; Supplier Part Number 1: 495-5365-ND; Supplier Part Number 2: B66206B1110T001; Supplier Part Number 4: 1422759; Supplier Part Number 5: 53M6943; Supplier Part Number 3: 871-B66206B1110T001
U1 = PS2811-1-M-A: Transistor Output Optocouplers Hi CTR Opto 1-Ch; Number of Channels: 1; If - Forward Current: 5 mA; Isolation Voltage: 2500 Vrms; Maximum Collector Emitter Saturation Voltage: 0.3 V; Vf - Forward Voltage: 1.15 V; Vr - Reverse Voltage: 6 V; Package / Case: SSOP-4; Supplier 1: Mouser; Supplier Part Number 1: 968-PS2811-1-F3-A
U2 = UCC28742: High-Efficiency Flyback Controller with Optocoupler Feedback - Texas Instruments; Supplier 1: Digi-Key; Supplier 2: Digi-Key; Supplier 3: Digi-Key; Supplier 4: Mouser; Supplier 5: Arrow; Supplier 6: Digi-Key; Supplier 7: Digi-Key; Supplier 8: Mouser; Supplier 9: Arrow; Supplier Part Number 9: UCC28742DBVR; Supplier Part Number 8: 595-UCC28742DBVR; Supplier Part Number 7: 296-52200-6-ND; Supplier Part Number 6: 296-52200-1-ND; Supplier Part Number 5: UCC28742DBVT; Supplier Part Number 4: 595-UCC28742DBVT; Supplier Part Number 3: 296-49499-2-ND; Supplier Part Number 2: 296-49499-6-ND; Supplier Part Number 1: 296-49499-1-ND
U3 = CMP-0063-00869-3: Low-Voltage (1.24V) Adjustable Precision Shunt Regulators, 5-pin SOT-23, Pb-Free; Manufacturer: Texas Instruments; CompType: MiscPower; PackageTopMarking: N09B*XTT; PowerWise: N; ComponentLink1URL: http://www.ti.com/general/docs/lit/getliterature.tsp?genericPartNumber=LMV431&fileType=pdf; ComponentLink1Description: Datasheet URL; PackageDescription: Molded SOT-23, .115 x .063 x .040 in Body, 5 Lead, .0375 in Pitch; PinCount: 5; PackageReference: DBV0005A; RoHS: Y